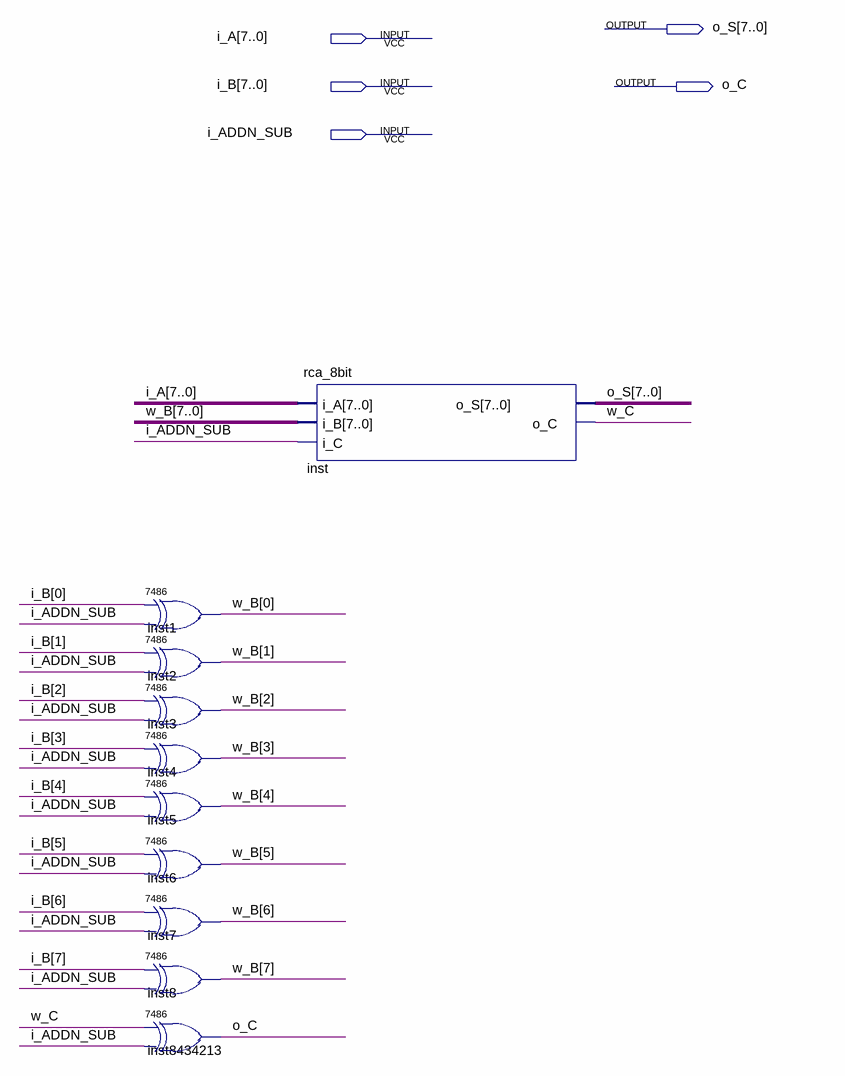
[diagram p0: schematic sheet]
// Quartus schematic addn_sub_8bit.bdf as structural Verilog: 10 symbols, 5 pins
module addn_sub_8bit (
  input  [7:0] i_A,
  input  [7:0] i_B,
  input  i_ADDN_SUB,
  output [7:0] o_S,
  output o_C
);

  wire w_C;
  wire [7:0] w_B;

  \7486  inst1 (.\2 (i_B[0]), .\3 (i_ADDN_SUB), .\1 (w_B[0]));
  \7486  inst2 (.\2 (i_B[1]), .\3 (i_ADDN_SUB), .\1 (w_B[1]));
  \7486  inst3 (.\2 (i_B[2]), .\3 (i_ADDN_SUB), .\1 (w_B[2]));
  \7486  inst4 (.\2 (i_B[3]), .\3 (i_ADDN_SUB), .\1 (w_B[3]));
  \7486  inst5 (.\2 (i_B[4]), .\3 (i_ADDN_SUB), .\1 (w_B[4]));
  \7486  inst6 (.\2 (i_B[5]), .\3 (i_ADDN_SUB), .\1 (w_B[5]));
  \7486  inst7 (.\2 (i_B[6]), .\3 (i_ADDN_SUB), .\1 (w_B[6]));
  \7486  inst8 (.\2 (i_B[7]), .\3 (i_ADDN_SUB), .\1 (w_B[7]));
  \7486  inst8434213 (.\2 (w_C), .\3 (i_ADDN_SUB), .\1 (o_C));
  rca_8bit inst (.i_A(i_A), .i_B(w_B), .i_C(i_ADDN_SUB), .o_S(o_S), .o_C(w_C));
endmodule
